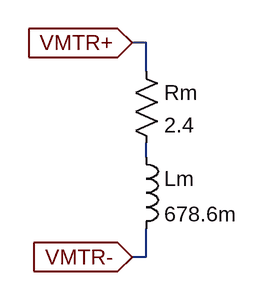
[diagram p0: schematic mtr.asc]
mtr.asc, the LTspice schematic file:
Version 4
SHEET 1 880 680
WIRE 320 16 304 16
WIRE 320 48 320 16
WIRE 320 144 320 128
WIRE 320 256 320 224
WIRE 320 256 304 256
FLAG 304 256 VMTR-
IOPIN 304 256 In
FLAG 304 16 VMTR+
IOPIN 304 16 In
SYMBOL res 304 32 R0
SYMATTR InstName Rm
SYMATTR Value 2.4
SYMBOL ind 304 128 R0
SYMATTR InstName Lm
SYMATTR Value 678.6m

The netlist it stands for:
* mtr.asc
Rm VMTR+ N001 2.4
Lm N001 VMTR- 678.6m
.backanno
.end